# Altium schematic sheet CutMonitor_MCU.SchDoc
size 594 x 420 mm; DocumentNumber: ФНКЦ.452312.001 Э3; SheetNumber: 2; Format: A2
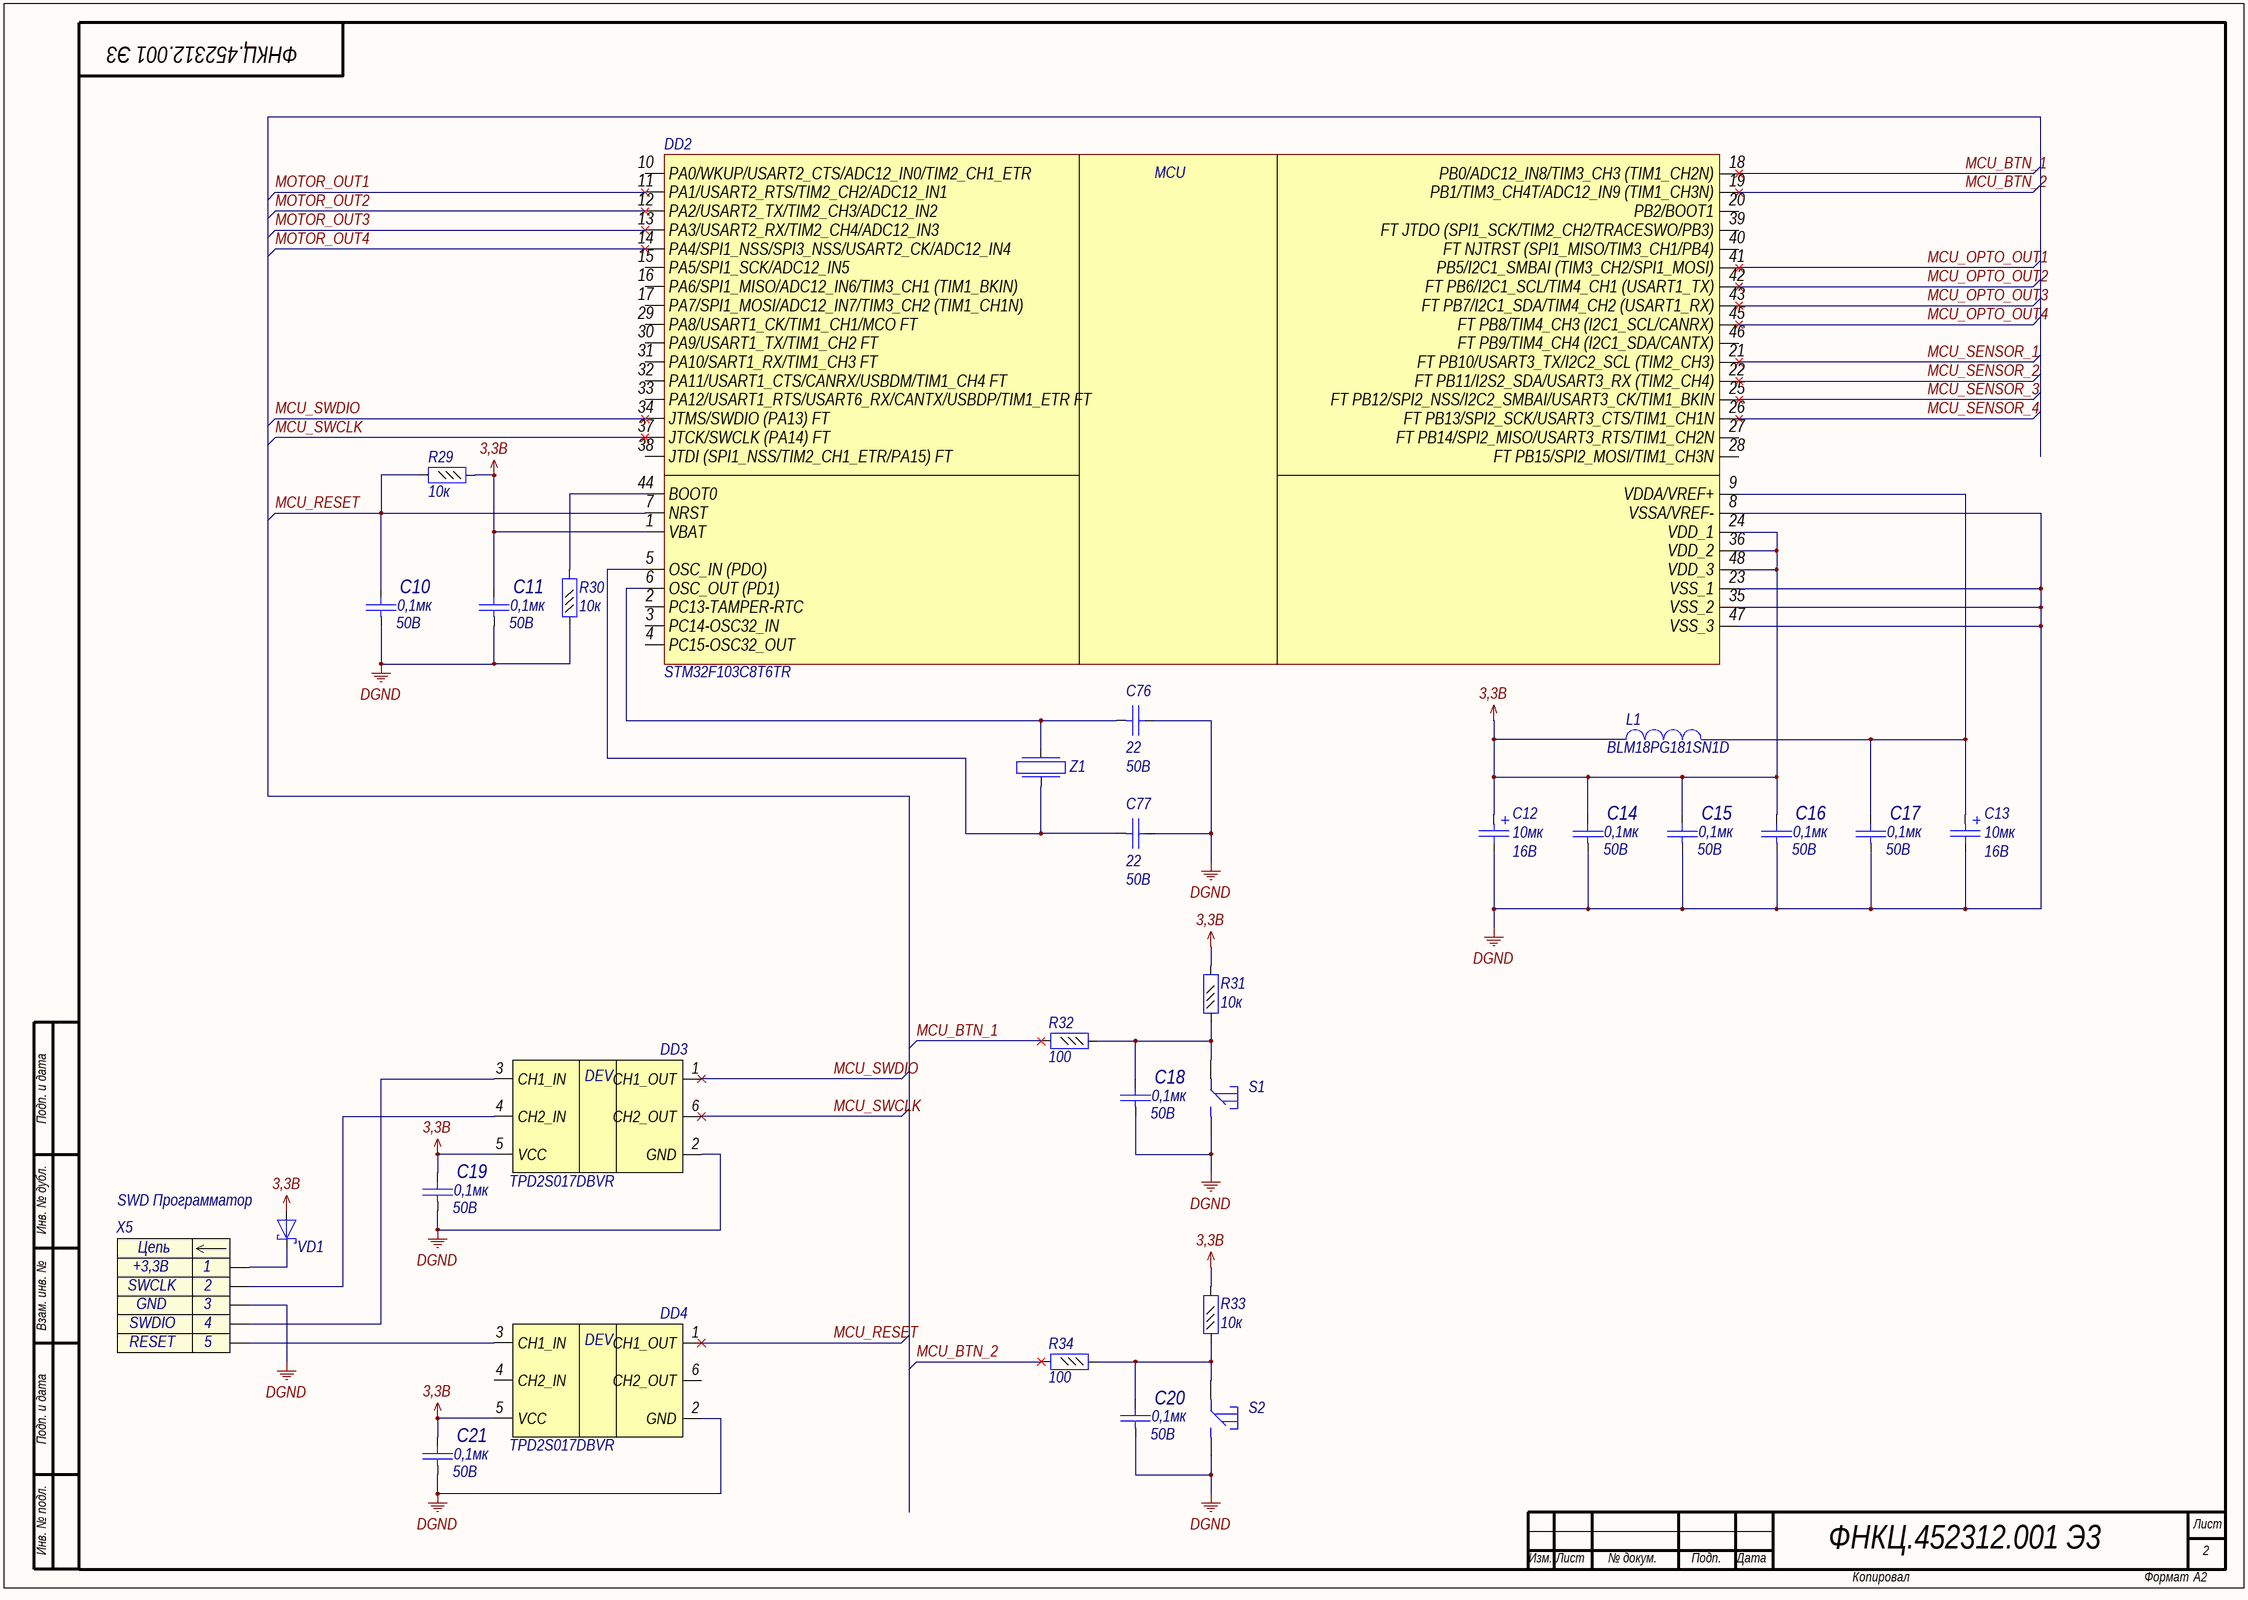
[diagram p0: CutMonitor_MCU.SchDoc]

## Parts
C10  value 0,1мк  Voltage: 50B  [C0603]  (hidden comment: Capacitor)
C11  value 0,1мк  Voltage: 50B  [C0603]  (hidden comment: Capacitor)
C12  value 10мк  Voltage: 16В  [TANTAL CASE A]  (hidden comment: Capacitor_pol)
C13  value 10мк  Voltage: 16В  [TANTAL CASE A]  (hidden comment: Capacitor_pol)
C14  value 0,1мк  Voltage: 50B  [C0603]  (hidden comment: Capacitor)
C15  value 0,1мк  Voltage: 50B  [C0603]  (hidden comment: Capacitor)
C16  value 0,1мк  Voltage: 50B  [C0603]  (hidden comment: Capacitor)
C17  value 0,1мк  Voltage: 50B  [C0603]  (hidden comment: Capacitor)
C18  value 0,1мк  Voltage: 50B  [C0603]  (hidden comment: Capacitor)
C19  value 0,1мк  Voltage: 50B  [C0603]  (hidden comment: Capacitor)
C20  value 0,1мк  Voltage: 50B  [C0603]  (hidden comment: Capacitor)
C21  value 0,1мк  Voltage: 50B  [C0603]  (hidden comment: Capacitor)
C76  value 22  Voltage: 50B  [C0603]  (hidden comment: Capacitor)
C77  value 22  Voltage: 50B  [C0603]  (hidden comment: Capacitor)
DD2  STM32F103C8T6TR  [LQFP48]
DD3  Part Number: TPD2S017DBVR  [SOT23-6]  (hidden comment: TPD2S017)
DD4  Part Number: TPD2S017DBVR  [SOT23-6]  (hidden comment: TPD2S017)
L1  Part Number: BLM18PG181SN1D  [L0603]  (hidden comment: Inductor)
R29  value 10к  [R0603]  (hidden comment: Resistor_0,062Вт)
R30  value 10к  [R0603]  (hidden comment: Resistor_0,062Вт)
R31  value 10к  [R0603]  (hidden comment: Resistor_0,062Вт)
R32  value 100  [R0603]  (hidden comment: Resistor_0,062Вт)
R33  value 10к  [R0603]  (hidden comment: Resistor_0,062Вт)
R34  value 100  [R0603]  (hidden comment: Resistor_0,062Вт)
S1  Button  [Button_SMD]  (value not drawn)
S2  Button  [Button_SMD]  (value not drawn)
VD1  DiodeSchottky  [SOD-523]  (value not drawn)
X5  SWD Программатор  [PLS-5]
Z1  Crystal  [QSMD5.0x3.2x1.0]  (value not drawn)

## Nets
3,3B: C11.2 C12.1 C14.2 C15.2 C16.2 C19.2 C21.2 DD2.1(VBAT) DD2.24(VDD_1) DD2.36(VDD_2) DD2.48(VDD_3) DD3.5(VCC) DD4.5(VCC) L1.1 R29.1 R31.2 R33.2 VD1.2(A)
DGND: C10.1 C11.1 C12.2 C13.2 C14.1 C15.1 C16.1 C17.1 C18.1 C19.1 C20.1 C21.1 C76.2 C77.2 DD2.8(VSSA/VREF-) DD2.23(VSS_1) DD2.35(VSS_2) DD2.47(VSS_3) DD3.2(GND) DD4.2(GND) R30.1 S1.4 S2.4 X5.3
MCU_BTN_1: DD2.18(PB0/ADC12_IN8/TIM3_CH3_(TIM1_CH2N)) R32.2
MCU_BTN_2: DD2.19(PB1/TIM3_CH4T/ADC12_IN9_(TIM1_CH3N)) R34.2
MCU_OPTO_OUT1: DD2.41(PB5/I2C1_SMBAI_(TIM3_CH2/SPI1_MOSI))
MCU_OPTO_OUT2: DD2.42(FT_PB6/I2C1_SCL/TIM4_CH1_(USART1_TX))
MCU_OPTO_OUT3: DD2.43(FT_PB7/I2C1_SDA/TIM4_CH2_(USART1_RX))
MCU_OPTO_OUT4: DD2.45(FT_PB8/TIM4_CH3_(I2C1_SCL/CANRX))
MCU_RESET: C10.2 DD2.7(NRST) DD4.1(CH1_OUT) R29.2
MCU_SENSOR_1: DD2.21(FT_PB10/USART3_TX/I2C2_SCL_(TIM2_CH3))
MCU_SENSOR_2: DD2.22(FT_PB11/I2S2_SDA/USART3_RX_(TIM2_CH4))
MCU_SENSOR_3: DD2.25(FT_PB12/SPI2_NSS/I2C2_SMBAI/USART3_CK/TIM1_BKIN)
MCU_SENSOR_4: DD2.26(FT_PB13/SPI2_SCK/USART3_CTS/TIM1_CH1N)
MCU_SWCLK: DD2.37(JTCK/SWCLK_(PA14)_FT) DD3.6(CH2_OUT)
MCU_SWDIO: DD2.34(JTMS/SWDIO_(PA13)_FT) DD3.1(CH1_OUT)
MOTOR_OUT1: DD2.11(PA1/USART2_RTS/TIM2_CH2/ADC12_IN1)
MOTOR_OUT2: DD2.12(PA2/USART2_TX/TIM2_CH3/ADC12_IN2)
MOTOR_OUT3: DD2.13(PA3/USART2_RX/TIM2_CH4/ADC12_IN3)
MOTOR_OUT4: DD2.14(PA4/SPI1_NSS/SPI3_NSS/USART2_CK/ADC12_IN4)
NetC13_1: C13.1 C17.2 DD2.9(VDDA/VREF+) L1.2
NetC18_2: C18.2 R31.1 R32.1 S1.1
NetC20_2: C20.2 R33.1 R34.1 S2.1
NetC76_1: C76.1 DD2.6(OSC_OUT_(PD1)) Z1.2
NetC77_1: C77.1 DD2.5(OSC_IN_(PDO)) Z1.1
NetDD2_44: DD2.44(BOOT0) R30.2
NetDD3_3: DD3.3(CH1_IN) X5.4
NetDD3_4: DD3.4(CH2_IN) X5.2
NetDD4_3: DD4.3(CH1_IN) X5.5
NetVD1_1: VD1.1(K) X5.1

Not connected (* = marked no-connect by the designer): DD2 2(PC13-TAMPER-RTC) 3(PC14-OSC32_IN) 4(PC15-OSC32_OUT) 10(PA0/WKUP/USART2_CTS/ADC12_IN0/TIM2_CH1_ETR) 15(PA5/SPI1_SCK/ADC12_IN5) 16(PA6/SPI1_MISO/ADC12_IN6/TIM3_CH1_(TIM1_BKIN)) 17(PA7/SPI1_MOSI/ADC12_IN7/TIM3_CH2_(TIM1_CH1N)) 20(PB2/BOOT1) 27(FT_PB14/SPI2_MISO/USART3_RTS/TIM1_CH2N) 28(FT_PB15/SPI2_MOSI/TIM1_CH3N) 29(PA8/USART1_CK/TIM1_CH1/MCO_FT) 30(PA9/USART1_TX/TIM1_CH2_FT) 31(PA10/SART1_RX/TIM1_CH3_FT) 32(PA11/USART1_CTS/CANRX/USBDM/TIM1_CH4_FT) 33(PA12/USART1_RTS/USART6_RX/CANTX/USBDP/TIM1_ETR_FT) 38(JTDI_(SPI1_NSS/TIM2_CH1_ETR/PA15)_FT) 39(FT_JTDO_(SPI1_SCK/TIM2_CH2/TRACESWO/PB3)) 40(FT_NJTRST_(SPI1_MISO/TIM3_CH1/PB4)) 46(FT_PB9/TIM4_CH4_(I2C1_SDA/CANTX)); DD4 4(CH2_IN) 6(CH2_OUT)

## Notes on the sheet
- Подп. и дата
- Инв. № дубл.
- Взам. инв. №
- Инв. № подл.
- Лист
- Изм.
- № докум.
- Подп.
- Дата
- Копировал
- Формат
- (in symbol connect6) Цепь
- (in symbol microcont0) MСU
- (in symbol TPD2S017DBVR) DEV

## Library data of the parts
C10 C11 C14-C21 = cap131: Конденсатор; Part Name: Ceramic; Manufacture: Murata; Part Number: GRM188R71H104KA93D; id: cap131; TKE: X7R
C12 C13 = cap199: Конденсатор полярный; Part Name: Tantal; Manufacture: Vishay; Part Number: 293D106X9016A2TE3; id: cap199
C76 C77 = cap77: Конденсатор; Part Name: Ceramic; Manufacture: Yageo; Part Number: CC0603JRNPO9BN220; id: cap77; TKE: NP0
DD2 = microcont0: Medium-density performance line ARM®-based 32-bit MCU with 64  or 128 KB Flash, USB, CAN, 7 timers, 2 ADCs, 9 com. interfaces; Part Name: Microcontroller; Frequency: 72MHz; ADC: 10x12b; Interface: can, i2c, irda, lin, spi, uart, usb; Flash: 64kb; Pin in: 37; Power Supply: 2.0-3.6 V; id: microcont0; Part Number: STM32F103C8T6TR
DD3 DD4 = TPD2S017DBVR: EMI Filter; Part Name: ESD Suppressors; Manufacture: Texas Instruments; id: esd4; Max Reverse Voltage: 12B; Capacitance: 1pF; Number of Channels: 2
L1 = ind0: EMI Suppression Filter; Part Name: EMI Suppression Filters; Rated Current: 1,5A; id: ind0; Resistance: 0,09Ohm
R29-R31 R33 = res483: Резистор; Manufacture: Yageo; Part Number: RC0603FR-0710KL; id: res483; Accuracy: 0,01; Part Name: Resistor; Power: 0,062Вт
R32 R34 = res435: Резистор; Manufacture: Yageo; Part Number: RC0603FR-07100RL; id: res435; Accuracy: 0,01; Part Name: Resistor; Power: 0,062Вт
S1 S2 = btn4: Кнопка; Part Name: Button 5mm; id: btn4
VD1 = diode12: Диод Шоттки; Part Number: PMEG2010AEB.115; Manufacture: NXP Semiconductor; Max Reverse Voltage: 20B; Forward Voltage: 0,62B; Forward Current: 1А; Breakdown Current: 600uA; Capacitance: 25pF; Number of Channels: 1; id: diode12; Part Name: Diode Schottky
X5 = connect6: Разъем - 5 конт. вилка; Part Number: DS1021-1*5SF112-B; Manufacture: Ningbo connfly electronic; Contact_1: +3,3B; Contact_2: SWCLK; Contact_3: GND; Contact_4: SWDIO; Contact_5: RESET; Etch: 2,54mm; Part Name: PLS-5; id: connect6
Z1 = crystal0: Кварцевый резонатор; Manufacture: GEYER; Part Number: KX-9A; Frequence: 8MHz; id: crystal0